# EAGLE design siu-clock-breakout (EAGLE 7.7.0)
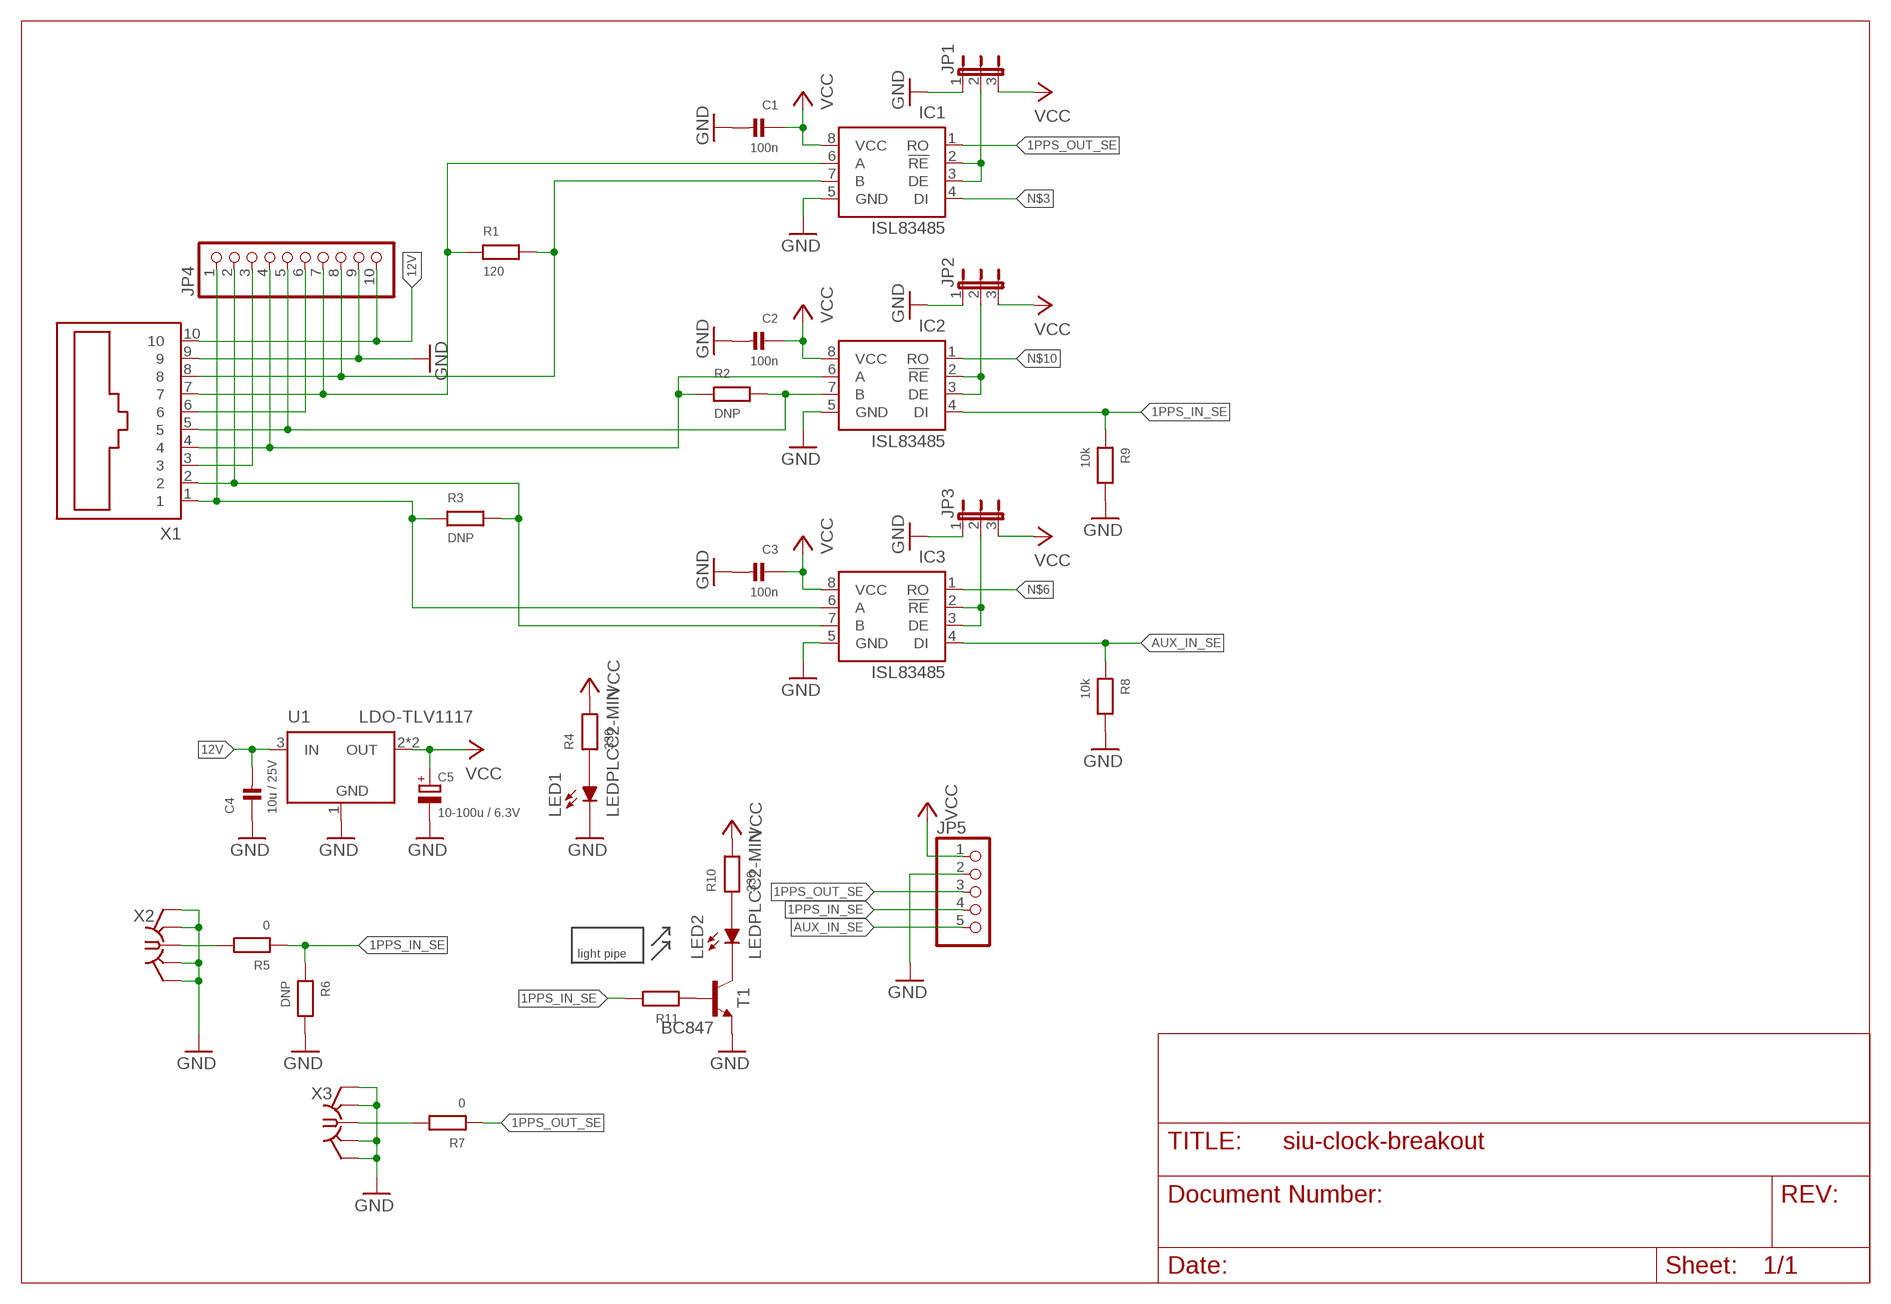
[diagram p0: schematic, sheet 1]

## Parts
C1  100n  CAP_CERAMIC_0603  [_0603]
C2  100n  CAP_CERAMIC_0603  [_0603]
C3  100n  CAP_CERAMIC_0603  [_0603]
C4  10u / 25V  CAP_CERAMIC_0805  [_0805]
C5  10-100u / 6.3V  CPOL-EU-1206  [CPOL1206]
IC1  ISL83485  LTC485S  [SOIC8]
IC2  ISL83485  LTC485S  [SOIC8]
IC3  ISL83485  LTC485S  [SOIC8]
JP1  JP2E  [JP2]
JP2  JP2E  [JP2]
JP3  JP2E  [JP2]
JP4  PINHD-1X10  [1X10]
JP5  PINHD-1X5  [1X05]
LED1  LEDPLCC2-MIN  [PLCC2-MIN]
LED2  LEDPLCC2-MIN  [PLCC2-MIN]
M1  MENTOR_12701001  [1270.1001]
R1  120  RESISTOR_0805  [_0805]
R2  DNP  RESISTOR_0805  [_0805]
R3  DNP  RESISTOR_0805  [_0805]
R4  330  RESISTOR_0603  [_0603]
R5  0  RESISTOR_0603  [_0603]
R6  DNP  RESISTOR_0603  [_0603]
R7  0  RESISTOR_0603  [_0603]
R8  10k  RESISTOR_0603  [_0603]
R9  10k  RESISTOR_0603  [_0603]
R10  330  RESISTOR_0603  [_0603]
R11  RESISTOR_0603  [_0603]
T1  BC847  BC847C-NPN-SOT23-BEC  [SOT23-BEC]
U1  LDO-TLV1117  [SOT223]
X1  RJ45-10P10C-SS-641010-NF  [SS-641010-NF]
X2  SMA-F-S-TH  [SMA-F-S-TH]
X3  SMA-F-S-TH  [SMA-F-S-TH]

## Nets
1PPS_IN_A: IC2.6(A) JP4.4 R2.1 X1.4
1PPS_IN_B: IC2.7(B) JP4.5 R2.2 X1.5
1PPS_IN_SE: IC2.4(DI) JP5.4 R5.1 R6.1 R9.1 R11.2
1PPS_OUT_A: IC1.6(A) JP4.7 R1.1 X1.7
1PPS_OUT_B: IC1.7(B) JP4.8 R1.2 X1.8
1PPS_OUT_SE: IC1.1(RO) JP5.3 R7.1
12V: C4.2 JP4.10 U1.3(IN) X1.10
AUX_IN_A: IC3.6(A) JP4.1 R3.1 X1.1
AUX_IN_B: IC3.7(B) JP4.2 R3.2 X1.2
AUX_IN_SE: IC3.4(DI) JP5.5 R8.1
GND: C1.2 C2.2 C3.2 C4.1 C5.- IC1.5(GND) IC2.5(GND) IC3.5(GND) JP1.1 JP2.1 JP3.1 JP4.9 JP5.2 LED1.K(C) R6.2 R8.2 R9.2 T1.E U1.1(GND) X1.9 X2.G1(GND) X2.G2(GND) X2.G3(GND) X2.G4(GND) X3.G1(GND) X3.G2(GND) X3.G3(GND) X3.G4(GND)
N$1: LED2.A R10.1
N$2: LED2.K(C) T1.C
N$3: IC1.4(DI)
N$4: R11.1 T1.B
N$6: IC3.1(RO)
N$7: IC2.2(!RE) IC2.3(DE) JP2.2
N$8: IC3.2(!RE) IC3.3(DE) JP3.2
N$9: IC1.2(!RE) IC1.3(DE) JP1.2
N$10: IC2.1(RO)
N$11: JP4.3 X1.3
N$12: JP4.6 X1.6
N$13: LED1.A R4.1
N$14: R7.2 X3.C
N$16: R5.2 X2.C
VCC: C1.1 C2.1 C3.1 C5.+ IC1.8(VCC) IC2.8(VCC) IC3.8(VCC) JP1.3 JP2.3 JP3.3 JP5.1 R4.2 R10.2 U1.2(OUT) U1.4(OUT)

## Library data of the parts
C1-C4 = rc-sysmocom:CAP_CERAMIC: Ceramic Capacitors 0402 - 0402 Surface Mount Capacitors 16pF 50V 5% [Digikey: 445-4899-2-ND] 18pF 50V 5% [Digikey: 490-1281-2-ND] 22pF 50V 5% [Digikey: 490-1283-2-ND] 68pF 50V 5% [Digikey: 490-1289-2-ND] 0.1uF 10V 10% [Digikey: 490-1318-2-ND] 1.0uF 6.3V 10% [Digikey: 490-1320-2-ND] 0603 - 0603 Surface Mount Capacitors 16 pF 50V 5% [Digikey: 445-5051-2-ND] 22 pF 50V [Digikey: PCC220ACVTR-ND] 33 pF 50V 5% [Digikey: 490-1415-1-ND] 56pF 50V 5% [Digikey: 490-1421-1-ND] 220pF 50V 5% [Digikey: 445-1285-1-ND] 680 pF 50V 2200 pF 50V 5% C0G [Digikey: 445-1297-1-ND] 5600 pF 100V 5% X7R [Digikey: 478-3711-1-ND] 0.1 µF 25V 10% [Digikey: PCC2277TR-ND] 0.22 µF 16V 10% X7R [Digikey: 445-1318-1-ND] 1.0 µF 25V 10% [Digikey: 445-5146-2-ND] 0603 - RF Specific 3pF 250V +/-0.1pF RF [Digikey: 712-1347-1-ND] 18 pF 250V 5% [Digikey: 478-3505-1-ND or 712-1322-1-ND] 56 pF 250V 5% C0G RF [Digikey: 490-4867-1-ND] 68 pF 250V RF [Digikey: 490-4868-1-ND] 0805 - 0805 Surface Mount Capacitors 220 pF 250V 2% RF Ceramic Capacitor [Digikey: 712-1398-1-ND] 1000 pF 50V 2% NP0 Ceramic Capacitor [Digikey: 478-3760-1-ND] 0.1 µF 25V 10% Ceramic Capacitor [Digikey: PCC1828TR-ND] 1.0 µF 16V 10% Ceramic Capacitor[Digikey: 490-1691-2-ND] 10.0 µF 10V 10% Ceramic Capacitor[Digikey: 709-1228-1-ND] 10.0 uF 16V 10% Ceramic Capacitor [Digikey: 478-5165-2-ND] 47 uF 6.3V 20% Ceramic Capacitor [Digikey: 587-1779-1-ND or 399-5506-1-ND] 1206 - 1206 Surface Mount Capacitors 47uF 10V 20% Ceramic Capacitor [Digikey: 490-5528-1-ND or 399-5508-1-ND or 445-6010-1-ND] 100uF 6.3V -20%, +80% Y5V Ceramic Capacitor (Digikey: 490-4512-1-ND, Mouser: 81-GRM31CF50J107ZE1L) 1810 - 1810 Surface Mount Capacitors High volt MLC; no solder stop between for higher isolation
C5 = rc-sysmocom:CPOL-EU
IC1-IC3 = linear-technology:LTC485: Low Power RS485 Interface Transceiver Source: http://www.linear.com/pc/downloadDocument.do?navId=H0,C1,C1007,C1017,P2064,D1718; OC_FARNELL: unknown; OC_NEWARK: unknown
JP1-JP3 = jumper:JP2E: JUMPER
JP4 = pinhead:PINHD-1X10: PIN HEADER
JP5 = pinhead:PINHD-1X5: PIN HEADER
LED1 LED2 = LED-PLCC2:LED: OSRAM types LY T676, LS T670 in P-LLC2 package side-LED types LY A676, LS A676
M1 = Mentor_lightpipe:MENTOR_12701001: MENTOR 1270.1001, PCB Mounted 2-Way Right Angle LED Light Pipe, Bi-Level Clear Round Lens
R1-R11 = rc-sysmocom:RESISTOR: Resistors 0402 - 0402 Surface Mount Package 22 Ohm 1% 1/16W [Digikey: 311-22.0LRTR-ND] 33 Ohm 5% 1/16W 1.0K 5% 1/16W 1.5K 5% 1/16W 2.0K 1% 1/16W 10.0K 1% 1/16W [Digikey: 311-10.0KLRTR-ND] 10.0K 5% 1/16W [Digikey: RMCF0402JT10K0TR-ND] 12.1K 1% 1/16W [Digikey: 311-22.0LRTR-ND] 100.0K 5% 1/16W 0603 - 0603 Surface Mount Package 1/10 Watt 0805 - 0805 Surface Mount Package 1/8 Watt 1206 - 1206 Surface Mount Package 2012 - 2010 Surface Mount Package 0.11 Ohm 1/2 Watt 1% Resistor - Digikey: RHM.11UCT-ND
T1 = transistor:*-NPN-: NPN Transistror BF959 corrected 2008.03.06; CLASS: UNKNOWN CLASS; DESCRIPTION: TRANS NPN 45V 0.1A SOT23; LINK: https://www.digikey.de/product-detail/de/nexperia-usa-inc/BC847C,215/1727-2924-1-ND; MANUFACTURER: Nexperia USA Inc.; MANUFACTURERPARTNUMBER: BC847C,215; POPULATED: TRUE; ROHSCERTIFICATE: Bleifrei / RoHS-konform; SOURCE: DIGIKEY; SOURCEPARTNUMBER: 1727-2924-1-ND
U1 = ldo:LDO
X1 = stewart-rj45:RJ45-10P10C
X2 X3 = laforge:SMA-F

## Board
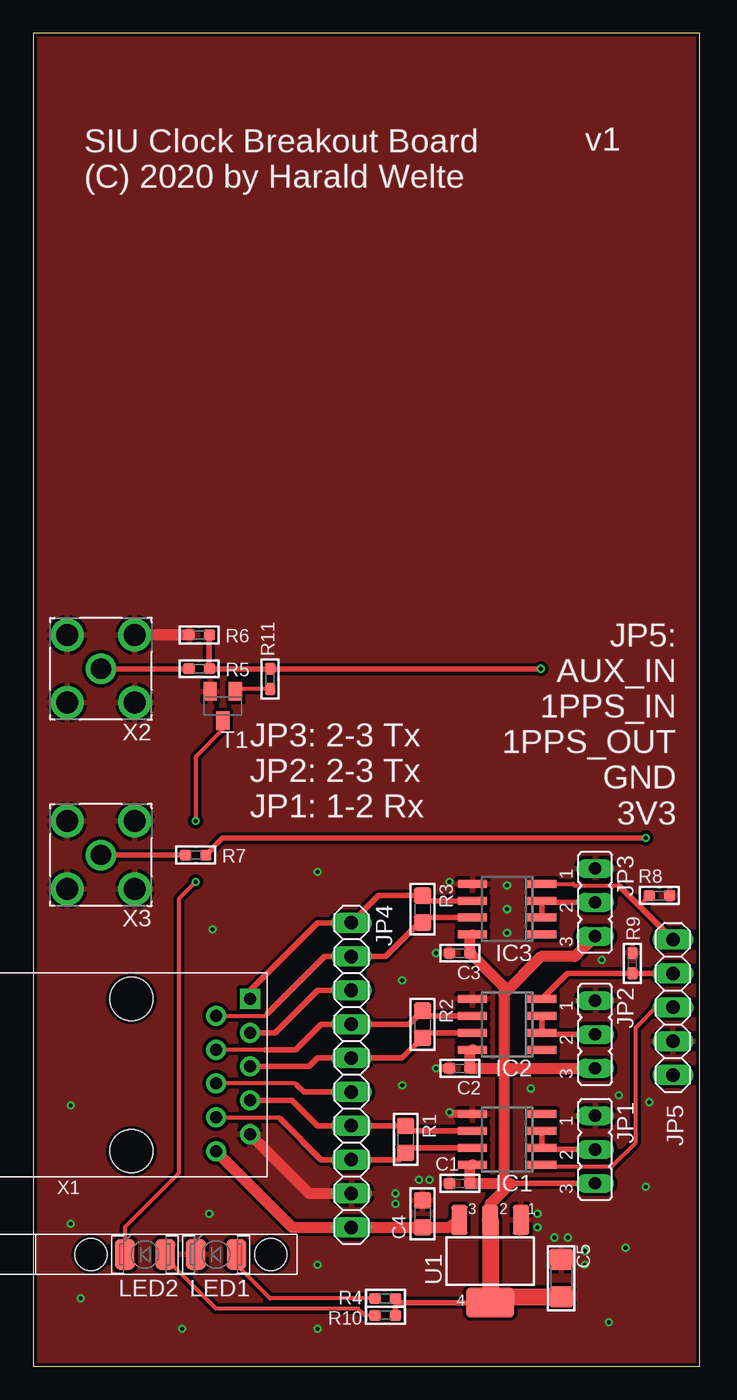
[diagram p1: board, top side]
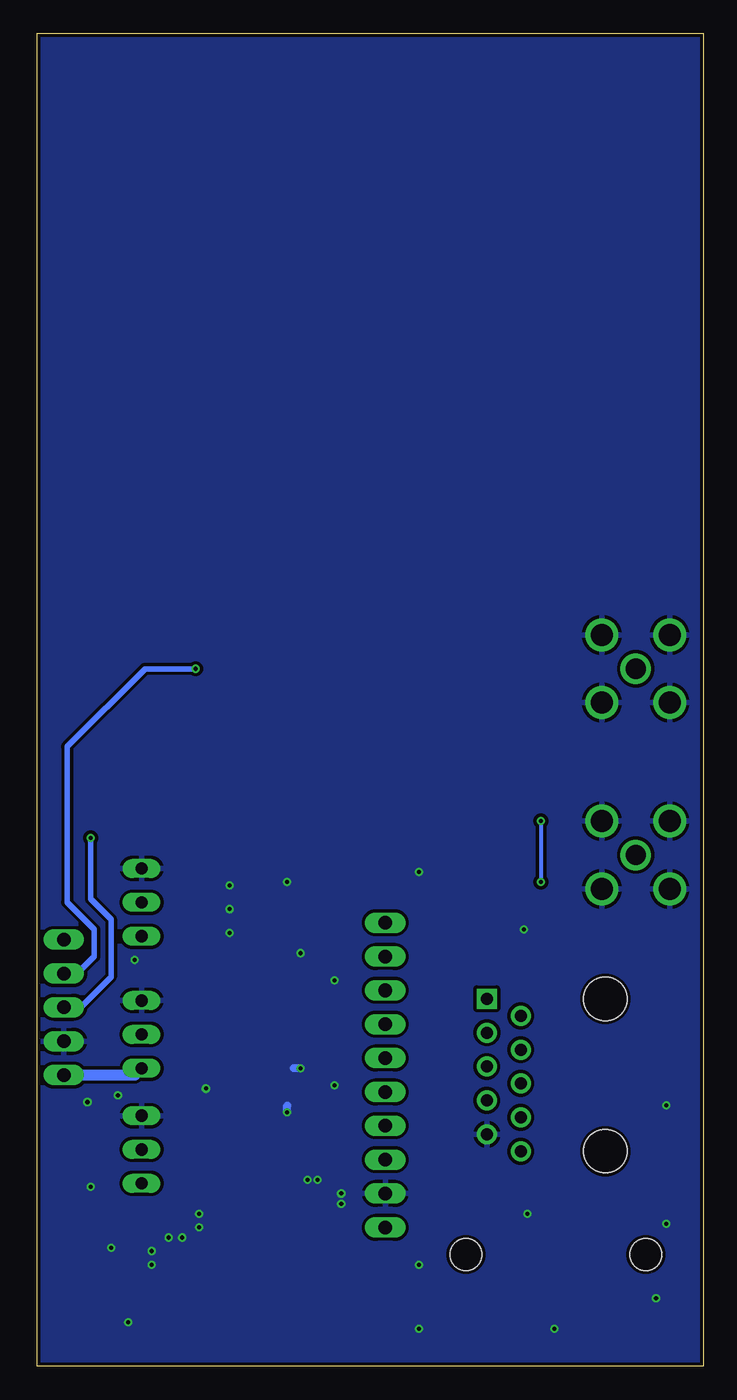
[diagram p2: board, bottom side, seen from below]

Size 50 x 100 mm. Coordinates in mm from the lower left corner, seen from the top.
Outline: 0,0 50,0 50,100 0,100 0,0
Copper layers (1*16): Top 0.035mm / dielectric 1.5mm / Bottom 0.035mm
Design rules "SeeedStudio_2layer_DRU_no_angle_20140221 *": minimum track width 6mil, minimum drill 12mil, track to track 10mil, track to pad 10mil, pad to pad 6mil, via to via 6mil, smd to smd 0mil, copper to edge 10mil, drill to drill 10mil, minimum pad ring 10mil, minimum via ring 6mil, stop-mask expansion 2mil, vias tented up to drill 100mil, thermal gap 10mil
tRestrict: area 23.6,26.7 to 24.9,27.2; area 23.6,29.2 to 24.9,29.7; area 23.4,21.6 to 24.6,22.1; area 23.4,19.1 to 24.6,19.6

### Footprints (pad centres in the part's own frame; a part is rotated, then mirrored left to right if it is on the bottom)
_0603 = smd 0.9 x 0.8: 1 -0.762,0; 2 0.762,0
_0805 = smd 1.2 x 1.3: 1 -1.016,0; 2 1.016,0
CPOL1206 = smd 1.6 x 1.8: + 1.4,0; - -1.4,0
SOIC8 = smd 0.6 x 2.2: 1 -1.905,-2.6; 2 -0.635,-2.6; 3 0.635,-2.6; 4 1.905,-2.6; 5 1.905,2.6; 6 0.635,2.6; 7 -0.635,2.6; 8 -1.905,2.6
JP2 = drill 0.914 long: 1 -2.54,0; 2 0,0; 3 2.54,0
1X10 = drill 1.016 long: 1 -11.43,0; 2 -8.89,0; 3 -6.35,0; 4 -3.81,0; 5 -1.27,0; 6 1.27,0; 7 3.81,0; 8 6.35,0; 9 8.89,0; 10 11.43,0
1X05 = drill 1.016 long: 1 -5.08,0; 2 -2.54,0; 3 0,0; 4 2.54,0; 5 5.08,0
PLCC2-MIN = smd 1.5 x 2.3: A -1.524,0; K 1.524,0
1270.1001 = hole 2.4: 13.5,0; 0,0
SOT23-BEC = smd 1 x 1.4: B -0.95,-1.1; C 0,1.1; E 0.95,-1.1
SOT223 = smd 1.219 x 2.235: 1 -2.311,-3.099; 2 0,-3.099; 3 2.311,-3.099 | smd 3.6 x 2.2: 4 0,3.099
SS-641010-NF = drill 0.9 pad 1.5 square: 1 -5.715,8.89 | drill 0.9 pad 1.5: 2 -4.445,6.35; 3 -3.175,8.89; 4 -1.905,6.35; 5 -0.635,8.9; 6 0.635,6.35; 7 1.905,8.9; 8 3.175,6.35; 9 4.445,8.89; 10 5.715,6.35 | hole 3.251: -5.715,0; 5.715,0
SMA-F-S-TH = drill 1.524: C 0,0 | drill 1.651: G1 -2.54,2.54; G2 2.54,2.54; G3 -2.54,-2.54; G4 2.54,-2.54

### Placement (x,y rotation side)
C1  32,13.72 180 top
C2  32,22.35 180 top
C3  32,30.99 180 top
C4  29.21,11.43 270 top
C5  39.62,6.6 270 top
IC1  35.56,17.02 90 top
IC2  35.56,25.65 90 top
IC3  35.56,34.29 90 top
JP1  42.16,16.26 270 top
JP2  42.16,24.89 270 top
JP3  42.16,34.8 270 top
JP4  23.88,21.84 270 top
JP5  48.01,26.92 90 top
LED1  13.72,8.38 180 top
LED2  8.38,8.38 180 top
M1  4.32,8.38 0 top
R1  27.94,17.02 270 top
R2  29.21,25.65 270 top
R3  29.21,34.29 270 top
R4  26.42,5.08 0 top
R5  12.45,52.32 180 top
R6  12.45,54.86 180 top
R7  12.19,38.35 180 top
R8  46.99,35.31 0 top
R9  44.96,30.23 90 top
R10  26.42,3.81 0 top
R11  17.78,51.56 90 top
T1  14.22,49.53 180 top
U1  34.29,7.87 180 top
X1  7.37,21.84 270 top
X2  5.08,52.32 180 top
X3  5.08,38.35 180 top

### Tracks (layer width: path | path; a pad name or v marks a point on that pad's centre or on a via)
1PPS_IN_A
  Top 0.305: 17.4,23.75 X1.4
  Top 0.406: 17.4,23.75 19.68,23.75 21.59,25.65 JP4.4 28.19,25.65 R2.1 29.59,26.29 IC2.6
1PPS_IN_B
  Top 0.406: X1.5 20.7,22.48 21.34,23.11 JP4.5 27.69,23.11 R2.2 29.59,25.02 IC2.7
1PPS_IN_SE  (via drill 0.3)
  Top 0.406: JP5.4 R9.1 40.06,29.46 IC2.4 | R6.1 R5.1 R11.2 v38.1,52.32
  Bottom 0.406: v38.1,52.32 41.91,52.32 47.75,46.48 47.75,34.8 45.72,32.77 45.72,30.73 46.99,29.46 JP5.4
1PPS_OUT_A
  Top 0.406: X1.7 19.43,19.94 21.34,18.03 JP4.7 R1.1 28.32,17.65 IC1.6
1PPS_OUT_B
  Top 0.305: X1.8 18.41,18.67 18.54,18.54
  Top 0.406: 18.54,18.54 21.59,15.49 JP4.8 27.43,15.49 R1.2 28.32,16.38 IC1.7
1PPS_OUT_SE  (via drill 0.3)
  Top 0.305: JP5.3 46.74,26.92 45.21,25.4 45.21,16.76 43.43,14.99 38.29,14.99 IC1.1
  Top 0.406: R7.1 14.22,39.62 v45.97,39.62
  Bottom 0.406: v45.97,39.62 45.97,35.05 44.45,33.53 44.45,29.21 46.74,26.92 JP5.3
12V
  Top 0.813: X1.10 19.43,10.41 JP4.10 C4.2 31.17,10.41 U1.3
AUX_IN_A
  Top 0.406: X1.1 16.26,28.19 21.34,33.27 JP4.1 25.91,35.31 R3.1 29.59,34.92 IC3.6
AUX_IN_B
  Top 0.305: X1.2 17.4,26.29 17.53,26.42
  Top 0.406: 17.53,26.42 21.84,30.73 JP4.2 26.42,30.73 28.7,33.02 28.96,33.27 | 28.96,33.27 R3.2 | IC3.7 29.34,33.66 28.96,33.27
AUX_IN_SE
  Top 0.305: IC3.4 40.51,36.2 40.64,36.07 43.94,36.07 | R8.1 45.47,34.54
  Top 0.406: 43.94,36.07 45.47,34.54 JP5.5
GND  (via drill 0.3)
  Top 0.61: IC1.5 31.37,18.92 v31.24,19.05 | C2.2 v30.23,22.35
  Top 0.813: X1.9 20.7,12.95 JP4.9 | R6.2 X2.G3
  Bottom 0.61: v31.24,19.05 31.24,19.56 | v30.23,22.35 30.73,22.35
  other vias: 39.12,9.65 40.13,9.65 41.4,7.62 41.4,8.64 37.85,11.43 37.85,10.41 27.18,12.95 27.18,12.19 29.72,13.97 28.96,13.97 30.23,30.99 31.24,36.32 35.56,36.07 35.56,34.29 35.56,32.51 27.69,28.96 27.69,21.08 37.34,20.83 3.56,5.08 43.94,20.32 46.23,19.81 45.97,13.46 2.79,10.67 2.79,19.56 13.46,32.77 21.34,37.08 13.21,11.43 21.34,7.62 11.18,2.79 21.34,2.79 43.18,3.3 44.45,8.89 42.67,30.48
  pour Bottom: 0,0.25 49.78,0.25 49.78,100.08 0,100.08
  pour Top: 0,0.25 49.78,0.25 49.78,100.08 0,100.08
N$1
  Top 0.305: R10.1 24.89,3.81 24.38,4.32 13.72,4.32 9.91,8.13 LED2.A
N$2  (via drill 0.3)
  Top 0.305: T1.C 14.22,47.75 12.19,45.72 v12.19,40.89 | v12.19,36.32 10.92,35.05 10.92,14.48 6.86,10.41 LED2.K
  Bottom 0.305: v12.19,40.89 v12.19,36.32
N$4
  Top 0.305: R11.1 15.34,50.8 T1.B
N$7
  Top 0.406: JP2.2 38.29,24.89 IC2.2 IC2.3
N$8
  Top 0.406: JP3.2 38.29,34.8 IC3.3 IC3.2
N$9
  Top 0.406: JP1.2 38.29,16.26 IC1.2 IC1.3
N$11
  Top 0.406: X1.3 18.16,25.02 21.34,28.19 JP4.3
N$12
  Top 0.305: 19.81,21.08 19.68,21.21 X1.6
  Top 0.406: JP4.6 20.32,20.57 19.81,21.08
N$13
  Top 0.305: R4.1 17.78,5.08 15.24,7.62 LED1.A
N$14
  Top 0.406: X3.C R7.2
N$16
  Top 0.406: X2.C R5.2
VCC
  Top 0.406: JP1.3 35.81,13.72 | U1.4 27.48,4.78 | 27.48,4.78 R4.2 | 27.48,4.78 27.18,4.47 R10.2
  Top 0.813: 35.81,13.72 35.69,13.59 | 35.69,13.59 35.31,13.21 | 35.31,13.21 34.29,12.19 U1.2 | 35.31,27.94 35.31,28.45 C3.1 32.77,32.19 IC3.8 | 35.31,27.94 35.31,22.61 | 35.31,22.61 35.31,13.21 | 35.69,13.59 35.56,13.72 C1.1 32.77,14.92 IC1.8 | 35.31,22.61 35.05,22.35 C2.1 32.77,23.55 IC2.8 | 35.31,22.61 35.56,22.35 JP2.3 | JP3.3 40.64,30.73 38.1,30.73 35.31,27.94
  Top 1.27: C5.+ 34.72,5.2 U1.4 U1.2
  Bottom 0.813: JP5.1 42.67,21.84 JP2.3

### Text on the board
tPlace: SIU Clock Breakout Board / (C) 2020 by Harald Welte | JP3: 2-3 Tx / JP2: 2-3 Tx / JP1: 1-2 Rx | JP5: / AUX_IN / 1PPS_IN / 1PPS_OUT / GND / 3V3